# EAGLE design sensor_v22 (EAGLE 8.0.0)
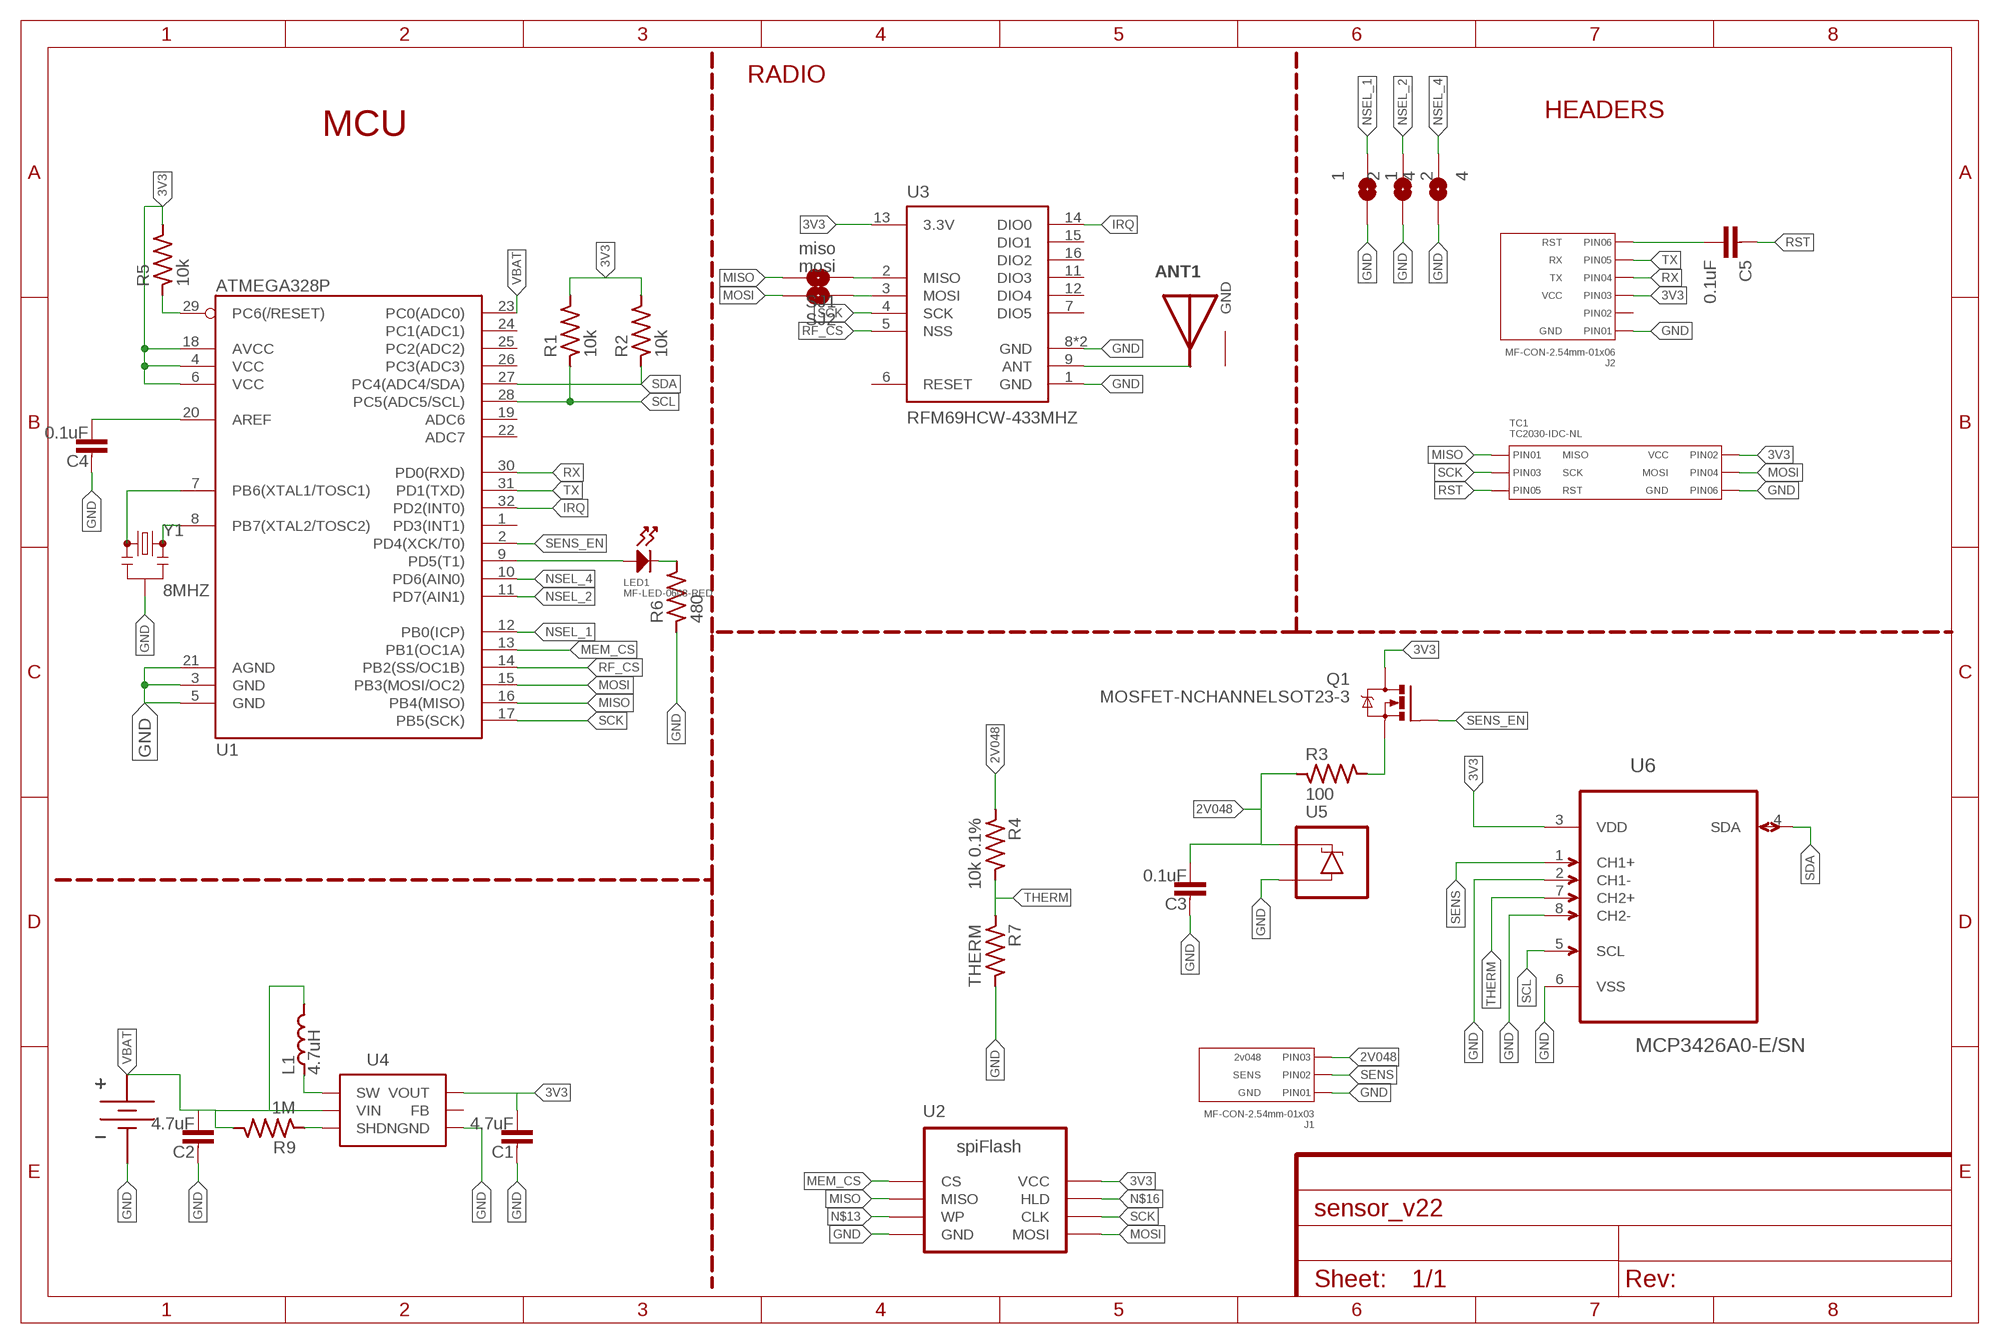
[diagram p0: schematic, sheet 1]

## Parts
1  1  SOLDERJUMPERNC2  [SJ_2S-NOTRACE]
2  2  SOLDERJUMPERNC2  [SJ_2S-NOTRACE]
4  4  SOLDERJUMPERNC2  [SJ_2S-NOTRACE]
ANT1  ANTENNA-2PIN-433_SP  [ANT_433_SP]
C1  4.7uF  CAPACITOR_NP0603-N  [C0603-N]
C2  4.7uF  CAPACITOR_NP0603-N  [C0603-N]
C3  0.1uF  CAPACITOR_NP0603-N  [C0603-N]
C4  0.1uF  CAPACITOR_NP0603-N  [C0603-N]
C5  0.1uF  CAPACITOR0603-N  [C0603-N]
J1  MF-CON-2.54mm-01x03  CON_01X03_PTH_2.54MM  [PTH_2.54MM_01X03]
J2  MF-CON-2.54mm-01x06  CON_01X06_PTH_2.54MM  [PTH_2.54MM_01X06]
L1  4.7uH  INDUCTOR3030  [L3030]
LED1  MF-LED-0603-RED  LED_SINGLE-0603-RED  [LED0603]
Q1  MOSFET-NCHANNELSOT23-3  [SOT23-3]
R1  10k  RESISTOR0603-N  [R0603-N]
R2  10k  RESISTOR0603-N  [R0603-N]
R3  100  RESISTOR0603-N  [R0603-N]
R4  10k 0.1%  RESISTOR0603-N  [R0603-N]
R5  10k  RESISTOR0603-N  [R0603-N]
R6  480  RESISTOR0603-N  [R0603-N]
R7  THERM  RESISTOR0603-N  [R0603-N]
R9  1M  RESISTOR0603-N  [R0603-N]
SJ1  miso  SOLDERJUMPERNC2  [SJ_2S-NOTRACE]
SJ2  mosi  SOLDERJUMPERNC2  [SJ_2S-NOTRACE]
TC1  TC2030-IDC-NL  CON_02X03_AVRISP_TC2030-IDC-NL  [TC2030-IDC-NL]
U1  ATMEGA328P  ATMEGA328P_SMD-AU  [TQFP32]
U2  WINBOND_FLASH_4MBIT-SOIC  [SOIC8]
U3  RFM69HCW-433MHZ  [RFM69HCW-XXXS2]
U4  AAT1217-SOT23-6  [SOT23-6]
U5  LM4040-SOT-23-3  [SOT23-3]
U6  MCP3426A0-E/SN  [SOIC127P600X175-8N]
U$1  KEYSTONEAAHOLDER_2CELL  [KEYSTONEAAHOLDER_2CELL]
Y1  8MHZ  RESONATOR8MHZ  [RESONATOR-SMD]

## Nets
2V048: C3.2 J1.P$3(PIN3) R3.1 R4.1 U5.1(C)
3V3: C1.2 J2.P$3(PIN3) Q1.3(D) R1.2 R2.2 R5.2 TC1.P$2(PIN2) U1.4(VCC) U1.6(VCC) U1.18(AVCC) U2.8(VCC) U3.13(3.3V) U4.5(VOUT) U6.3(VDD)
GND: 1.2 2.2 4.2 C1.1 C2.1 C3.1 C4.1 J1.P$1(PIN1) J2.P$1(PIN1) R6.1 R7.2 TC1.P$6(PIN6) U1.3(GND) U1.5(GND) U1.21(AGND) U2.4(GND) U3.1(GND) U3.8(GND) U3.10(GND) U4.2(GND) U5.2(A) U6.2(CH1-) U6.6(VSS) U6.8(CH2-) U$1.P$2(GND) Y1.2
IRQ: U1.32(PD2(INT0)) U3.14(DIO0)
MEM_CS: U1.13(PB1(OC1A)) U2.1(CS)
MISO: SJ1.2 TC1.P$1(PIN1) U1.16(PB4(MISO)) U2.2(MISO)
MOSI: SJ2.2 TC1.P$4(PIN4) U1.15(PB3(MOSI/OC2)) U2.5(MOSI)
N$1: R9.1 U4.4(SHDN)
N$2: ANT1.SIG U3.9(ANT)
N$3: LED1.ANODE U1.9(PD5(T1))
N$4: C4.2 U1.20(AREF)
N$5: LED1.CATHODE R6.2
N$6: L1.P$1 U4.1(SW)
N$7: U1.7(PB6(XTAL1/TOSC1)) Y1.1
N$8: U1.8(PB7(XTAL2/TOSC2)) Y1.3
N$9: SJ1.1 U3.2(MISO)
N$10: C5.2 J2.P$6(PIN6)
N$11: SJ2.1 U3.3(MOSI)
N$12: Q1.2(S) R3.2
N$13: U2.3(WP)
N$16: U2.7(HLD)
NSEL_1: 1.1 U1.12(PB0(ICP))
NSEL_2: 2.1 U1.11(PD7(AIN1))
NSEL_4: 4.1 U1.10(PD6(AIN0))
RF_CS: U1.14(PB2(SS/OC1B)) U3.5(NSS)
RST: C5.1 R5.1 TC1.P$5(PIN5) U1.29(PC6(/RESET))
RX: J2.P$4(PIN4) U1.30(PD0(RXD))
SCK: TC1.P$3(PIN3) U1.17(PB5(SCK)) U2.6(CLK) U3.4(SCK)
SCL: R1.1 U1.28(PC5(ADC5/SCL)) U6.5(SCL)
SDA: R2.1 U1.27(PC4(ADC4/SDA)) U6.4(SDA)
SENS: J1.P$2(PIN2) U6.1(CH1+)
SENS_EN: Q1.1(G) U1.2(PD4(XCK/T0))
THERM: R4.2 R7.1 U6.7(CH2+)
TX: J2.P$5(PIN5) U1.31(PD1(TXD))
VBAT: C2.2 L1.P$2 R9.2 U1.23(PC0(ADC0)) U4.6(VIN) U$1.P$1(VBAT)
Unconnected: ANT1.G1(GND) ANT1.G2(GND) ANT1.G3(GND) ANT1.G4(GND) ANT1.G5(GND) J2.P$2(PIN2) U1.1(PD3(INT1)) U1.19(ADC6) U1.22(ADC7) U1.24(PC1(ADC1)) U1.25(PC2(ADC2)) U1.26(PC3(ADC3)) U3.6(RESET) U3.7(DIO5) U3.11(DIO3) U3.12(DIO4) U3.15(DIO1) U3.16(DIO2) U4.3(FB)

## Notes on the sheet
- RADIO
- HEADERS
- MCU

## Library data of the parts
1 2 4 SJ1 SJ2 = My_Connectors:SOLDERJUMPER: Solder Jumper Standard SMD solder jumper. Used to automate production. Two varients : Normally Open and Normally Closed are the same, but have different paste layers. NC will have a large amount of paste and should jumper during reflow.
ANT1 = My_RF:ANTENNA-2PIN
C1-C4 = My_Passives:CAPACITOR_NP
C5 = passives-7351:CAPACITOR
J1 = My_Connectors:CON_01X03: Library: MF_Connectors Description: Header Connector with 03 Positions and 01 Rows. Use the LABEL Attribute to label the pin on the schematic and PCB. You can remove the attributes on the PCB by using the SMASH function on the part and then deleting the text.; HOUSEPART: YES; LABEL01: GND; LABEL02: SENS; LABEL03: 2v048; MPN: MF-CON-2.54mm-01x03; PARTNO: 0022053031; POPULATE: 1; URL: https://factory.macrofab.com/part/MF-CON-2.54mm-01x03
J2 = My_Connectors:CON_01X06: Library: MF_Connectors Description: Header Connector with 6 Positions and 01 Rows. Use the LABEL Attribute to label the pin on the schematic and PCB. You can remove the attributes on the PCB by using the SMASH function on the part and then deleting the text.; HOUSEPART: YES; LABEL01: GND; LABEL03: VCC; LABEL04: TX; LABEL05: RX; LABEL06: RST; MPN: MF-CON-2.54mm-01x06; POPULATE: 1; URL: https://factory.macrofab.com/part/MF-CON-2.54mm-01x06
L1 = My_Passives:INDUCTOR
LED1 = My_LEDs:LED_SINGLE: Library: MF_LEDs Description: Device for Single LED Packages. Manufacture part number (MFG#) can be added via Attributes.; HOUSEPART: YES; MPN: MF-LED-0603-RED; POPULATE: 1; URL: https://factory.macrofab.com/part/MF-LED-0603-RED
Q1 = My_Descrete_Semiconductors:MOSFET-NCHANNEL: Common NMOSFET Parts MFG P/N Store ID Prod ID FDD8780 TRANS-09984 SI7820DN TRANS-11055 FDS6630A IC-08089 2N7002PW TRANS-11151 FQP30N06L COM-10213 TRANS-10060 BSS123LT1G TRANS-08345 BSS138 TRANS-00830 BS170 2N7000
R1-R3 R5 R6 R9 = My_Passives:RESISTOR
R4 = My_Passives:RESISTOR; PARTNO: 0.1% !!
R7 = My_Passives:RESISTOR; PARTNO: FIND PART!!
TC1 = My_Connectors:CON_02X03: Library: MF_Connectors Description: Header Connector with 6 Positions and 02 Rows. Use the LABEL Attribute to label the pin on the schematic and PCB. You can remove the attributes on the PCB by using the SMASH function on the part and then deleting the text.; HOUSEPART: NO; LABEL01: MISO; LABEL02: VCC; LABEL03: SCK; LABEL04: MOSI; LABEL05: RST; LABEL06: GND; MPN: TC2030-IDC-NL; PARTNO: NA; POPULATE: 0; URL: http://www.tag-connect.com/AVRISP
U1 = My_IC_Digital:ATMEGA328P_SMD: Atmel 32-pin 8-bit micro 16k flash.
U2 = My_IC_Digital:WINBOND_FLASH_4MBIT
U3 = My_RF:RFM69H; PARTNO: COM-13910; PROD_ID: IC-11997, IC-12053
U4 = My_IC_Power:AAT1217; PARTNO: AAT1217ICA-3.3-T1
U5 = My_Descrete_Semiconductors:LM4040; PARTNO: LM4040AIM3-2.0/NOPB
U6 = Microchip_By_element14_Batch_1:MCP3426A0-E/SN: Analog-to-Digital Converter; MPN: MCP3426A0-E/SN; OC_FARNELL: 1825012; OC_NEWARK: 52R9954; PACKAGE: SOIC-8; SUPPLIER: Microchip
U$1 = _my-parts:KEYSTONEAAHOLDER_2CELL
Y1 = My_xTal:RESONATOR: Resonator Small SMD resonator. Used, eg, on the Arduino Pro/ Pro Mini boards. 8MHz- XTAL-08895 16MHz- XTAL-08900; PARTNO: CSTCE8M00G55-R0; PROD_ID: XTAL-08895

## Board
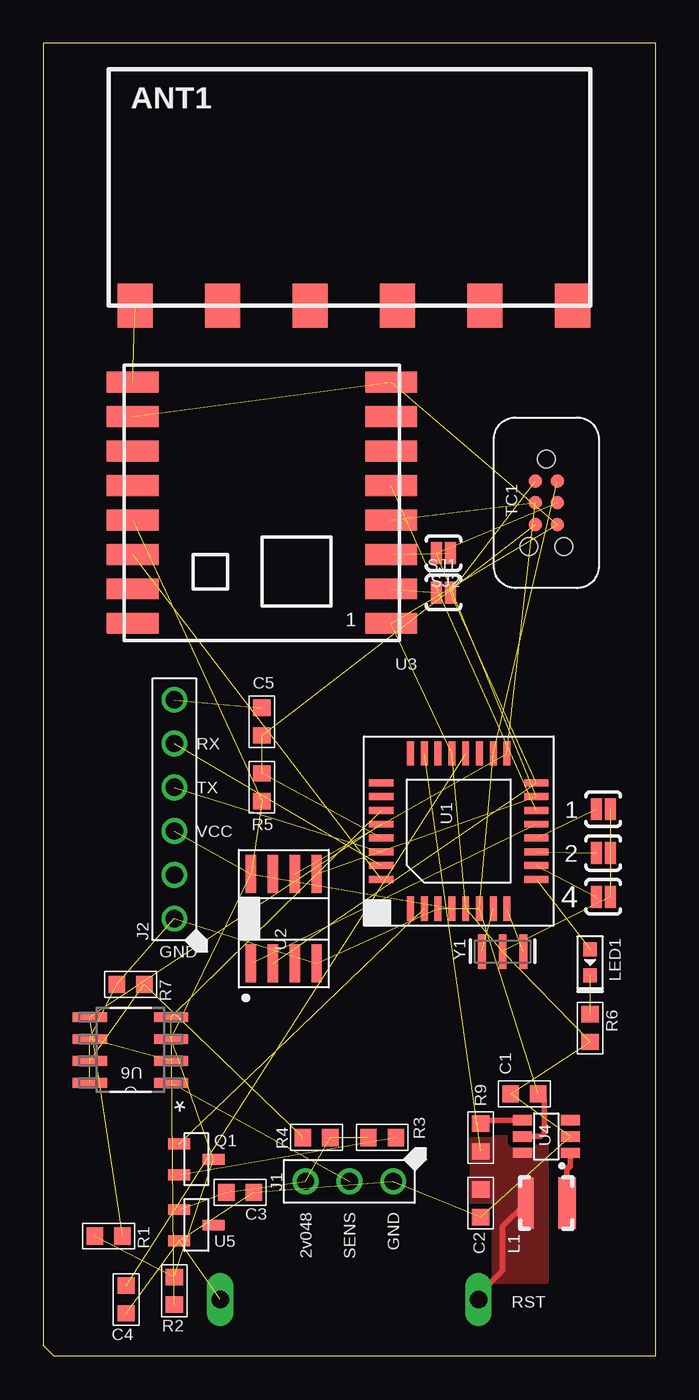
[diagram p1: board, top side]

Size 35.56 x 76.2 mm. Coordinates in mm from the lower left corner, seen from the top.
Outline: 0,76.2 0,0.64 0.64,0 35.56,0 35.56,76.2 0,76.2
Copper layers (1*16): Top 0.0178mm / dielectric 59mil / Bottom 0.0178mm
Design rules "SSC-EAGLE-2Lyr_v1.0.0.3": minimum track width 6mil, minimum drill 14mil, track to track 6mil, track to pad 6mil, pad to pad 6mil, via to via 6mil, smd to smd 6mil, copper to edge 20mil, drill to drill 16mil, minimum pad ring 8mil, minimum via ring 8mil, stop-mask expansion 3mil, vias tented up to drill 0mil, thermal gap 10mil

### Footprints (pad centres in the part's own frame; a part is rotated, then mirrored left to right if it is on the bottom)
SJ_2S-NOTRACE = smd 0.635 x 1.27: 1 -0.401,0; 2 0.413,0
ANT_433_SP = smd 2.032 x 2.54: G1 6.604,0; G2 11.684,0; G3 16.764,0; G4 21.844,0; G5 26.924,0; SIG 1.524,0
C0603-N = smd 0.95 x 1: 1 -0.8,0; 2 0.8,0
PTH_2.54MM_01X03 = drill 1: P$1 -2.54,0; P$2 0,0; P$3 2.54,0
PTH_2.54MM_01X06 = drill 1: P$1 -6.35,0; P$2 -3.81,0; P$3 -1.27,0; P$4 1.27,0; P$5 3.81,0; P$6 6.35,0
L3030 = smd 1 x 3: P$1 -1.2,0 | smd 0.9 x 3: P$2 1.2,0
LED0603 = smd 0.8 x 0.8: ANODE 0.75,0; CATHODE -0.75,0
SOT23-3 = smd 0.635 x 1.27: 1 -0.9,-1; 2 0.9,-1; 3 0,1
R0603-N = smd 0.95 x 1: 1 -0.8,0; 2 0.8,0
TC2030-IDC-NL = smd 0.787 x 0.787: P$1 -1.27,-0.635; P$2 -1.27,0.635; P$3 0,-0.635; P$4 0,0.635; P$5 1.27,-0.635; P$6 1.27,0.635 | hole 0.991: 2.54,1.016; 2.54,-1.016; -2.54,0
TQFP32 = smd 1.4 x 0.4: 1 -4.5,2.8; 2 -4.5,2; 3 -4.5,1.2; 4 -4.5,0.4; 5 -4.5,-0.4; 6 -4.5,-1.2; 7 -4.5,-2; 8 -4.5,-2.8; 17 4.5,-2.8; 18 4.5,-2; 19 4.5,-1.2; 20 4.5,-0.4; 21 4.5,0.4; 22 4.5,1.2; 23 4.5,2; 24 4.5,2.8 | smd 0.4 x 1.4: 9 -2.8,-4.5; 10 -2,-4.5; 11 -1.2,-4.5; 12 -0.4,-4.5; 13 0.4,-4.5; 14 1.2,-4.5; 15 2,-4.5; 16 2.8,-4.5; 25 2.8,4.5; 26 2,4.5; 27 1.2,4.5; 28 0.4,4.5; 29 -0.4,4.5; 30 -1.2,4.5; 31 -2,4.5; 32 -2.8,4.5
SOIC8 = smd 2.2 x 0.6: 1 -2.6,1.905; 2 -2.6,0.635; 3 -2.6,-0.635; 4 -2.6,-1.905; 5 2.6,-1.905; 6 2.6,-0.635; 7 2.6,0.635; 8 2.6,1.905
RFM69HCW-XXXS2 = smd 3 x 1.2: 1 -7.5,7; 2 -7.5,5; 3 -7.5,3; 4 -7.5,1; 5 -7.5,-1; 6 -7.5,-3; 7 -7.5,-5; 8 -7.5,-7; 9 7.5,-7; 10 7.5,-5; 11 7.5,-3; 12 7.5,-1; 13 7.5,1; 14 7.5,3; 15 7.5,5; 16 7.5,7
SOT23-6 = smd 0.6 x 1.1: 1 0,0; 2 0.95,0; 3 1.9,0; 4 1.9,2.8; 5 0.95,2.8; 6 0,2.8
SOIC127P600X175-8N = smd 1.981 x 0.559: 1 -2.362,1.905; 2 -2.362,0.635; 3 -2.362,-0.635; 4 -2.362,-1.905; 5 2.362,-1.905; 6 2.362,-0.635; 7 2.362,0.635; 8 2.362,1.905
KEYSTONEAAHOLDER_2CELL = drill 1.016 pad 1.524 long: P$1 -7.493,27.178; P$2 7.493,27.178
RESONATOR-SMD = smd 0.45 x 2: 1 -1.2,0; 2 0,0; 3 1.2,0

### Placement (x,y rotation side)
1  32.51,31.75 0 top
2  32.51,29.21 0 top
4  32.51,26.67 0 top
ANT1  3.81,60.96 0 top
C1  27.94,15.24 0 top
C2  25.4,8.89 90 top
C3  11.43,9.53 180 top
C4  4.83,3.3 90 top
C5  12.7,36.83 90 top
J1  17.78,10.16 180 top
J2  7.62,31.75 90 top
L1  29.21,8.89 180 top
LED1  31.75,22.86 90 top
Q1  8.89,11.43 270 top
R1  3.81,6.99 180 top
R2  7.62,3.81 90 top
R3  19.68,12.7 0 top
R4  15.88,12.7 180 top
R5  12.7,33.02 270 top
R6  31.75,19.05 90 top
R7  5.08,21.59 180 top
R9  25.4,12.7 270 top
SJ1  23.24,44.32 0 top
SJ2  23.24,46.61 180 top
TC1  29.21,49.53 270 top
U1  24.13,30.48 90 top
U2  13.97,25.4 90 top
U3  12.7,49.53 180 top
U4  30.61,11.81 90 top
U5  8.89,7.62 270 top
U6  5.08,17.78 180 top
U$1  17.78,30.48 180 top
Y1  26.67,23.5 0 top

### Tracks (layer width: path | path; a pad name or v marks a point on that pad's centre or on a via)
2V048  (4 unrouted)
3V3  (12 unrouted)
  Top 0.305: U4.5 28.89,12.76 29.08,12.95 29.08,14.9 C1.2
GND  (25 unrouted)
IRQ  (1 unrouted)
MEM_CS  (1 unrouted)
MISO  (3 unrouted)
MOSI  (3 unrouted)
N$1
  Top 0.305: U4.4 25.61,13.71 R9.1
N$2  (1 unrouted)
N$3  (1 unrouted)
N$4  (1 unrouted)
N$5  (1 unrouted)
N$6
  Top 0.305: L1.P$1 30.41,10.85 30.61,11.05 U4.1
N$7  (1 unrouted)
N$8  (1 unrouted)
N$9  (1 unrouted)
N$10  (1 unrouted)
N$11  (1 unrouted)
N$12  (1 unrouted)
NSEL_1  (1 unrouted)
NSEL_2  (1 unrouted)
NSEL_4  (1 unrouted)
RF_CS  (1 unrouted)
RST  (3 unrouted)
RX  (1 unrouted)
SCK  (3 unrouted)
SCL  (2 unrouted)
SDA  (2 unrouted)
SENS  (1 unrouted)
SENS_EN  (1 unrouted)
THERM  (2 unrouted)
TX  (1 unrouted)
VBAT  (1 unrouted)
  Top 0.305: U$1.P$1 25.27,3.56 26.67,4.95 26.67,7.55 L1.P$2
  pour Top (isolate 0.305, no thermals): 24.89,8.89 26.16,8.89 26.16,4.32 29.21,4.32 29.21,12.32 27.43,12.32 27.43,12.7 24.89,12.7